# Altium project Small Neopixel (ws2812b) LED Matrix.PrjPcb
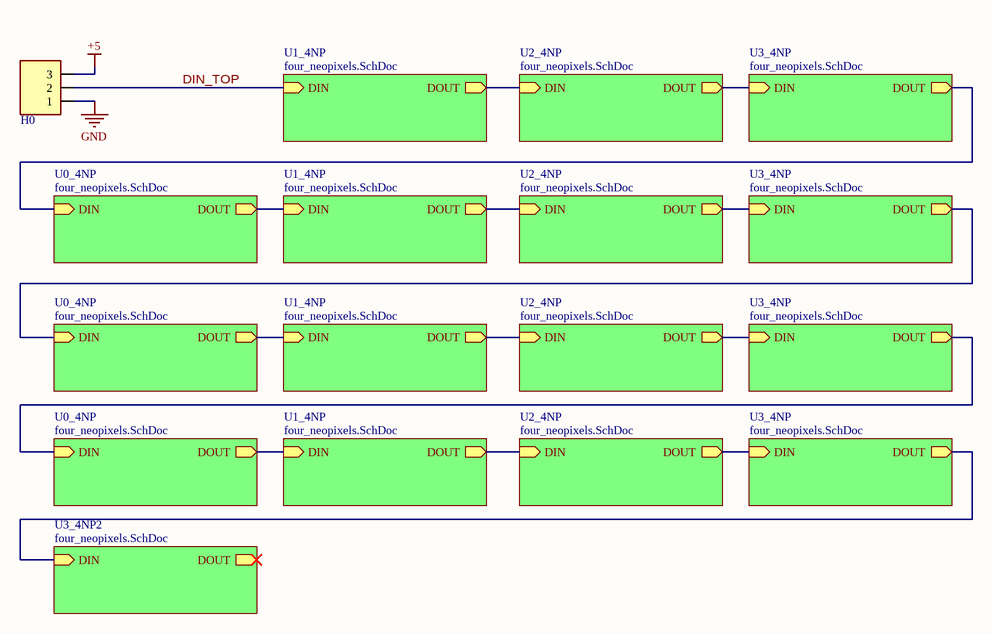
[diagram p0: small_matrix_ws2812_LEDs.SchDoc]
2 sheets, 129 parts. Net scope: hierarchical (ports join the sheet entries above them; power ports are global).
Board file: small_matrix_ws2812_LEDs.PcbDoc
Sheets:
  small_matrix_ws2812_LEDs.SchDoc
    U1_4NP = four_neopixels.SchDoc
    U2_4NP = four_neopixels.SchDoc
    U3_4NP = four_neopixels.SchDoc
    U0_4NP = four_neopixels.SchDoc
    U1_4NP = four_neopixels.SchDoc
    U2_4NP = four_neopixels.SchDoc
    U3_4NP = four_neopixels.SchDoc
    U0_4NP = four_neopixels.SchDoc
    U1_4NP = four_neopixels.SchDoc
    U2_4NP = four_neopixels.SchDoc
    U3_4NP = four_neopixels.SchDoc
    U0_4NP = four_neopixels.SchDoc
    U1_4NP = four_neopixels.SchDoc
    U2_4NP = four_neopixels.SchDoc
    U3_4NP = four_neopixels.SchDoc
    U3_4NP2 = four_neopixels.SchDoc

## Sheet small_matrix_ws2812_LEDs.SchDoc
size A; SheetNumber: 1; SheetTotal: 2

### Parts
H0  1x3 Male  [[No Series] Shrouded 1x3]  (value not drawn)

### Sub-sheets
U0_4NP = four_neopixels.SchDoc: DIN (in), DOUT (out)
U0_4NP = four_neopixels.SchDoc: DIN (in), DOUT (out)
U0_4NP = four_neopixels.SchDoc: DIN (in), DOUT (out)
U1_4NP = four_neopixels.SchDoc: DIN (in), DOUT (out)
U1_4NP = four_neopixels.SchDoc: DIN (in), DOUT (out)
U1_4NP = four_neopixels.SchDoc: DIN (in), DOUT (out)
U1_4NP = four_neopixels.SchDoc: DIN (in), DOUT (out)
U2_4NP = four_neopixels.SchDoc: DIN (in), DOUT (out)
U2_4NP = four_neopixels.SchDoc: DIN (in), DOUT (out)
U2_4NP = four_neopixels.SchDoc: DIN (in), DOUT (out)
U2_4NP = four_neopixels.SchDoc: DIN (in), DOUT (out)
U3_4NP = four_neopixels.SchDoc: DIN (in), DOUT (out)
U3_4NP = four_neopixels.SchDoc: DIN (in), DOUT (out)
U3_4NP = four_neopixels.SchDoc: DIN (in), DOUT (out)
U3_4NP = four_neopixels.SchDoc: DIN (in), DOUT (out)
U3_4NP2 = four_neopixels.SchDoc: DIN (in), DOUT (out)

### Nets
+5: H0.3
GND: H0.1
DIN_TOP: H0.2 ; sheet U1_4NP/DIN
NetL0_U0_4NP1_4: sheet U3_4NP/DOUT, sheet U0_4NP/DIN
NetL0_U0_4NP2_4: sheet U3_4NP/DOUT, sheet U0_4NP/DIN
NetL0_U0_4NP3_4: sheet U3_4NP/DOUT, sheet U0_4NP/DIN
NetL0_U1_4NP1_4: sheet U0_4NP/DOUT, sheet U1_4NP/DIN
NetL0_U1_4NP2_4: sheet U0_4NP/DOUT, sheet U1_4NP/DIN
NetL0_U1_4NP3_4: sheet U0_4NP/DOUT, sheet U1_4NP/DIN
NetL0_U2_4NP1_4: sheet U1_4NP/DOUT, sheet U2_4NP/DIN
NetL0_U2_4NP2_4: sheet U1_4NP/DOUT, sheet U2_4NP/DIN
NetL0_U2_4NP3_4: sheet U1_4NP/DOUT, sheet U2_4NP/DIN
NetL0_U2_4NP4_4: sheet U1_4NP/DOUT, sheet U2_4NP/DIN
NetL0_U3_4NP1_4: sheet U2_4NP/DOUT, sheet U3_4NP/DIN
NetL0_U3_4NP2#1_4: sheet U2_4NP/DOUT, sheet U3_4NP/DIN
NetL0_U3_4NP2#2_4: sheet U3_4NP/DOUT, sheet U3_4NP2/DIN
NetL0_U3_4NP3_4: sheet U2_4NP/DOUT, sheet U3_4NP/DIN
NetL0_U3_4NP4_4: sheet U2_4NP/DOUT, sheet U3_4NP/DIN

### Notes on the sheet
- Project/Vehicle:
- Author(s):
- -
- Revisor(s):
- Git Repo:
- Git Hash:
- Date:
- Revision:
- Size:
- A
- File:
- Sheet
- of

### Library data of the parts
H0 = [No Series] Shrouded 1x3: 1778777; Supplier 1: DigiKey; Supplier Part Number 1: 277-2316-1-ND

## Sheet four_neopixels.SchDoc
size A4; SheetNumber: 2; SheetTotal: 2
Used 16 times, as channels U1_4NP, U2_4NP, U3_4NP, U0_4NP, U1_4NP, U2_4NP, U3_4NP, U0_4NP, U1_4NP, U2_4NP, U3_4NP, U0_4NP, U1_4NP, U2_4NP, U3_4NP, U3_4NP2. Parts and nets are listed once, with the designators drawn on the sheet.
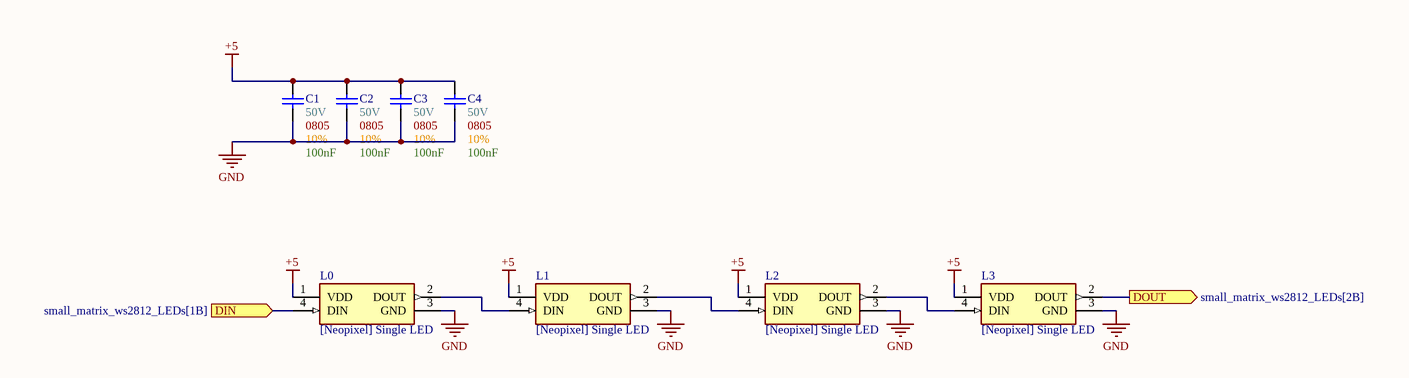
[diagram p1: four_neopixels.SchDoc]

### Parts
C1  Max Voltage: 50V  Size Package: 0805  Tolerance: 10%  Capacitance: 100nF  [[Cap] SMD 0805]  (hidden comment: [Cap] 0805 0.1uF 10% 50V)
C2  Max Voltage: 50V  Size Package: 0805  Tolerance: 10%  Capacitance: 100nF  [[Cap] SMD 0805]  (hidden comment: [Cap] 0805 0.1uF 10% 50V)
C3  Max Voltage: 50V  Size Package: 0805  Tolerance: 10%  Capacitance: 100nF  [[Cap] SMD 0805]  (hidden comment: [Cap] 0805 0.1uF 10% 50V)
C4  Max Voltage: 50V  Size Package: 0805  Tolerance: 10%  Capacitance: 100nF  [[Cap] SMD 0805]  (hidden comment: [Cap] 0805 0.1uF 10% 50V)
L0  [Neopixel] Single LED  [[Neopixel] Single LED]
L1  [Neopixel] Single LED  [[Neopixel] Single LED]
L2  [Neopixel] Single LED  [[Neopixel] Single LED]
L3  [Neopixel] Single LED  [[Neopixel] Single LED]

### Ports
DIN (in, see small_matrix_ws2812_LEDs[1B]), DOUT (out, see small_matrix_ws2812_LEDs[2B])

### Nets
+5: C1.2 C2.2 C3.2 C4.2 L0.1(VDD) L1.1(VDD) L2.1(VDD) L3.1(VDD)
GND: C1.1 C2.1 C3.1 C4.1 L0.3(GND) L1.3(GND) L2.3(GND) L3.3(GND)
DIN: L0.4(DIN) ; port DIN
DOUT: L3.2(DOUT) ; port DOUT
NetL0_2: L0.2(DOUT) L1.4(DIN)
NetL1_2: L1.2(DOUT) L2.4(DIN)
NetL2_2: L2.2(DOUT) L3.4(DIN)

### Channels
U1_4NP: designators end in _U1_4NP4; ports DIN=DIN_TOP DOUT=NetL0_U2_4NP4_4
U2_4NP: designators end in _U2_4NP4; ports DIN=NetL0_U2_4NP4_4 DOUT=NetL0_U3_4NP4_4
U3_4NP: designators end in _U3_4NP4; ports DIN=NetL0_U3_4NP4_4 DOUT=NetL0_U0_4NP3_4
U0_4NP: designators end in _U0_4NP3; ports DIN=NetL0_U0_4NP3_4 DOUT=NetL0_U1_4NP3_4
U1_4NP: designators end in _U1_4NP3; ports DIN=NetL0_U1_4NP3_4 DOUT=NetL0_U2_4NP3_4
U2_4NP: designators end in _U2_4NP3; ports DIN=NetL0_U2_4NP3_4 DOUT=NetL0_U3_4NP3_4
U3_4NP: designators end in _U3_4NP3; ports DIN=NetL0_U3_4NP3_4 DOUT=NetL0_U0_4NP2_4
U0_4NP: designators end in _U0_4NP2; ports DIN=NetL0_U0_4NP2_4 DOUT=NetL0_U1_4NP2_4
U1_4NP: designators end in _U1_4NP2; ports DIN=NetL0_U1_4NP2_4 DOUT=NetL0_U2_4NP2_4
U2_4NP: designators end in _U2_4NP2; ports DIN=NetL0_U2_4NP2_4 DOUT=NetL0_U3_4NP2#1_4
U3_4NP: designators end in _U3_4NP2#1; ports DIN=NetL0_U3_4NP2#1_4 DOUT=NetL0_U0_4NP1_4
U0_4NP: designators end in _U0_4NP1; ports DIN=NetL0_U0_4NP1_4 DOUT=NetL0_U1_4NP1_4
U1_4NP: designators end in _U1_4NP1; ports DIN=NetL0_U1_4NP1_4 DOUT=NetL0_U2_4NP1_4
U2_4NP: designators end in _U2_4NP1; ports DIN=NetL0_U2_4NP1_4 DOUT=NetL0_U3_4NP1_4
U3_4NP: designators end in _U3_4NP1; ports DIN=NetL0_U3_4NP1_4 DOUT=NetL0_U3_4NP2#2_4
U3_4NP2: designators end in _U3_4NP2#2; ports DIN=NetL0_U3_4NP2#2_4 DOUT=NetL3_U3_4NP2#2_2

### Notes on the sheet
- Project/Vehicle:
- Author(s):
- -
- Revisor(s):
- Git Repo:
- Git Hash:
- Date:
- Revision:
- Size:
- A4
- File:
- Sheet
- of

### Library data of the parts
C1-C4 = [Cap] 0805 0.1uF 10% 50V: CL21B104KBCNNNC; Supplier 1: DigiKey; Supplier Part Number 1: 1276-1003-6-ND
L0-L3 = [Neopixel] Single LED: WS2812B; Supplier 1: DigiKey; Supplier Part Number 1: 1568-16347CT-ND

## Nets that join several sheets
+5: small_matrix_ws2812_LEDs (H0.3), U1_4NP (8 pins), U2_4NP (8 pins), U3_4NP (8 pins), U0_4NP (8 pins), U1_4NP (8 pins), U2_4NP (8 pins), U3_4NP (8 pins), U0_4NP (8 pins), U1_4NP (8 pins), U2_4NP (8 pins), U3_4NP (8 pins), U0_4NP (8 pins), U1_4NP (8 pins), U2_4NP (8 pins), U3_4NP (8 pins), U3_4NP2 (8 pins)
GND: small_matrix_ws2812_LEDs (H0.1), U1_4NP (8 pins), U2_4NP (8 pins), U3_4NP (8 pins), U0_4NP (8 pins), U1_4NP (8 pins), U2_4NP (8 pins), U3_4NP (8 pins), U0_4NP (8 pins), U1_4NP (8 pins), U2_4NP (8 pins), U3_4NP (8 pins), U0_4NP (8 pins), U1_4NP (8 pins), U2_4NP (8 pins), U3_4NP (8 pins), U3_4NP2 (8 pins)
DIN_TOP: small_matrix_ws2812_LEDs (H0.2), U1_4NP (L0_U1_4NP4.4)
NetL0_U0_4NP1_4: U3_4NP (L3_U3_4NP2#1.2), U0_4NP (L0_U0_4NP1.4)
NetL0_U0_4NP2_4: U3_4NP (L3_U3_4NP3.2), U0_4NP (L0_U0_4NP2.4)
NetL0_U0_4NP3_4: U3_4NP (L3_U3_4NP4.2), U0_4NP (L0_U0_4NP3.4)
NetL0_U1_4NP1_4: U0_4NP (L3_U0_4NP1.2), U1_4NP (L0_U1_4NP1.4)
NetL0_U1_4NP2_4: U0_4NP (L3_U0_4NP2.2), U1_4NP (L0_U1_4NP2.4)
NetL0_U1_4NP3_4: U0_4NP (L3_U0_4NP3.2), U1_4NP (L0_U1_4NP3.4)
NetL0_U2_4NP1_4: U1_4NP (L3_U1_4NP1.2), U2_4NP (L0_U2_4NP1.4)
NetL0_U2_4NP2_4: U1_4NP (L3_U1_4NP2.2), U2_4NP (L0_U2_4NP2.4)
NetL0_U2_4NP3_4: U1_4NP (L3_U1_4NP3.2), U2_4NP (L0_U2_4NP3.4)
NetL0_U2_4NP4_4: U1_4NP (L3_U1_4NP4.2), U2_4NP (L0_U2_4NP4.4)
NetL0_U3_4NP1_4: U2_4NP (L3_U2_4NP1.2), U3_4NP (L0_U3_4NP1.4)
NetL0_U3_4NP2#1_4: U2_4NP (L3_U2_4NP2.2), U3_4NP (L0_U3_4NP2#1.4)
NetL0_U3_4NP2#2_4: U3_4NP (L3_U3_4NP1.2), U3_4NP2 (L0_U3_4NP2#2.4)
NetL0_U3_4NP3_4: U2_4NP (L3_U2_4NP3.2), U3_4NP (L0_U3_4NP3.4)
NetL0_U3_4NP4_4: U2_4NP (L3_U2_4NP4.2), U3_4NP (L0_U3_4NP4.4)